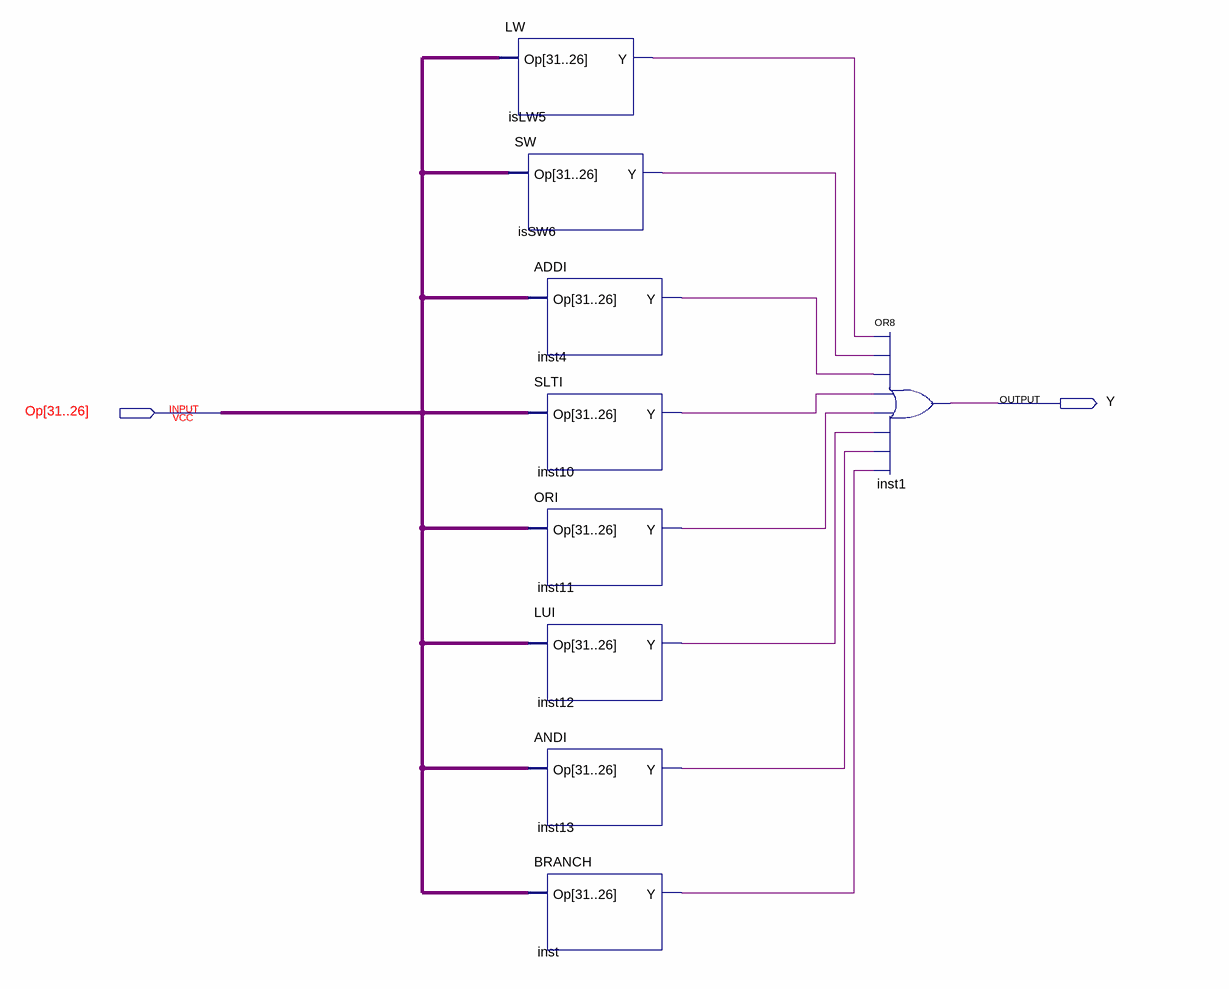
[diagram p0: schematic sheet]
// Quartus schematic ITYPE.bdf as structural Verilog: 9 symbols, 2 pins
module ITYPE (
  input  [31:26] Op,
  output Y
);

  wire inst4_y, inst10_y, inst11_y, inst12_y, inst13_y, inst_y, isLW5_y, isSW6_y;

  LW isLW5 (.Op(Op), .Y(isLW5_y));
  SW isSW6 (.Op(Op), .Y(isSW6_y));
  ADDI inst4 (.Op(Op), .Y(inst4_y));
  SLTI inst10 (.Op(Op), .Y(inst10_y));
  ORI inst11 (.Op(Op), .Y(inst11_y));
  LUI inst12 (.Op(Op), .Y(inst12_y));
  ANDI inst13 (.Op(Op), .Y(inst13_y));
  BRANCH inst (.Op(Op), .Y(inst_y));
  or inst1 (Y, isLW5_y, isSW6_y, inst4_y, inst10_y, inst11_y, inst12_y, inst13_y, inst_y);
endmodule
